# EasyEDA schematic SCH_Type B_2022-05-16.json
TITLE: Sheet_1; REV: 1.0; Date: 2022-05-16; Sheet: 1/1; Drawn By: baggioedoardo03; Company: Your Company
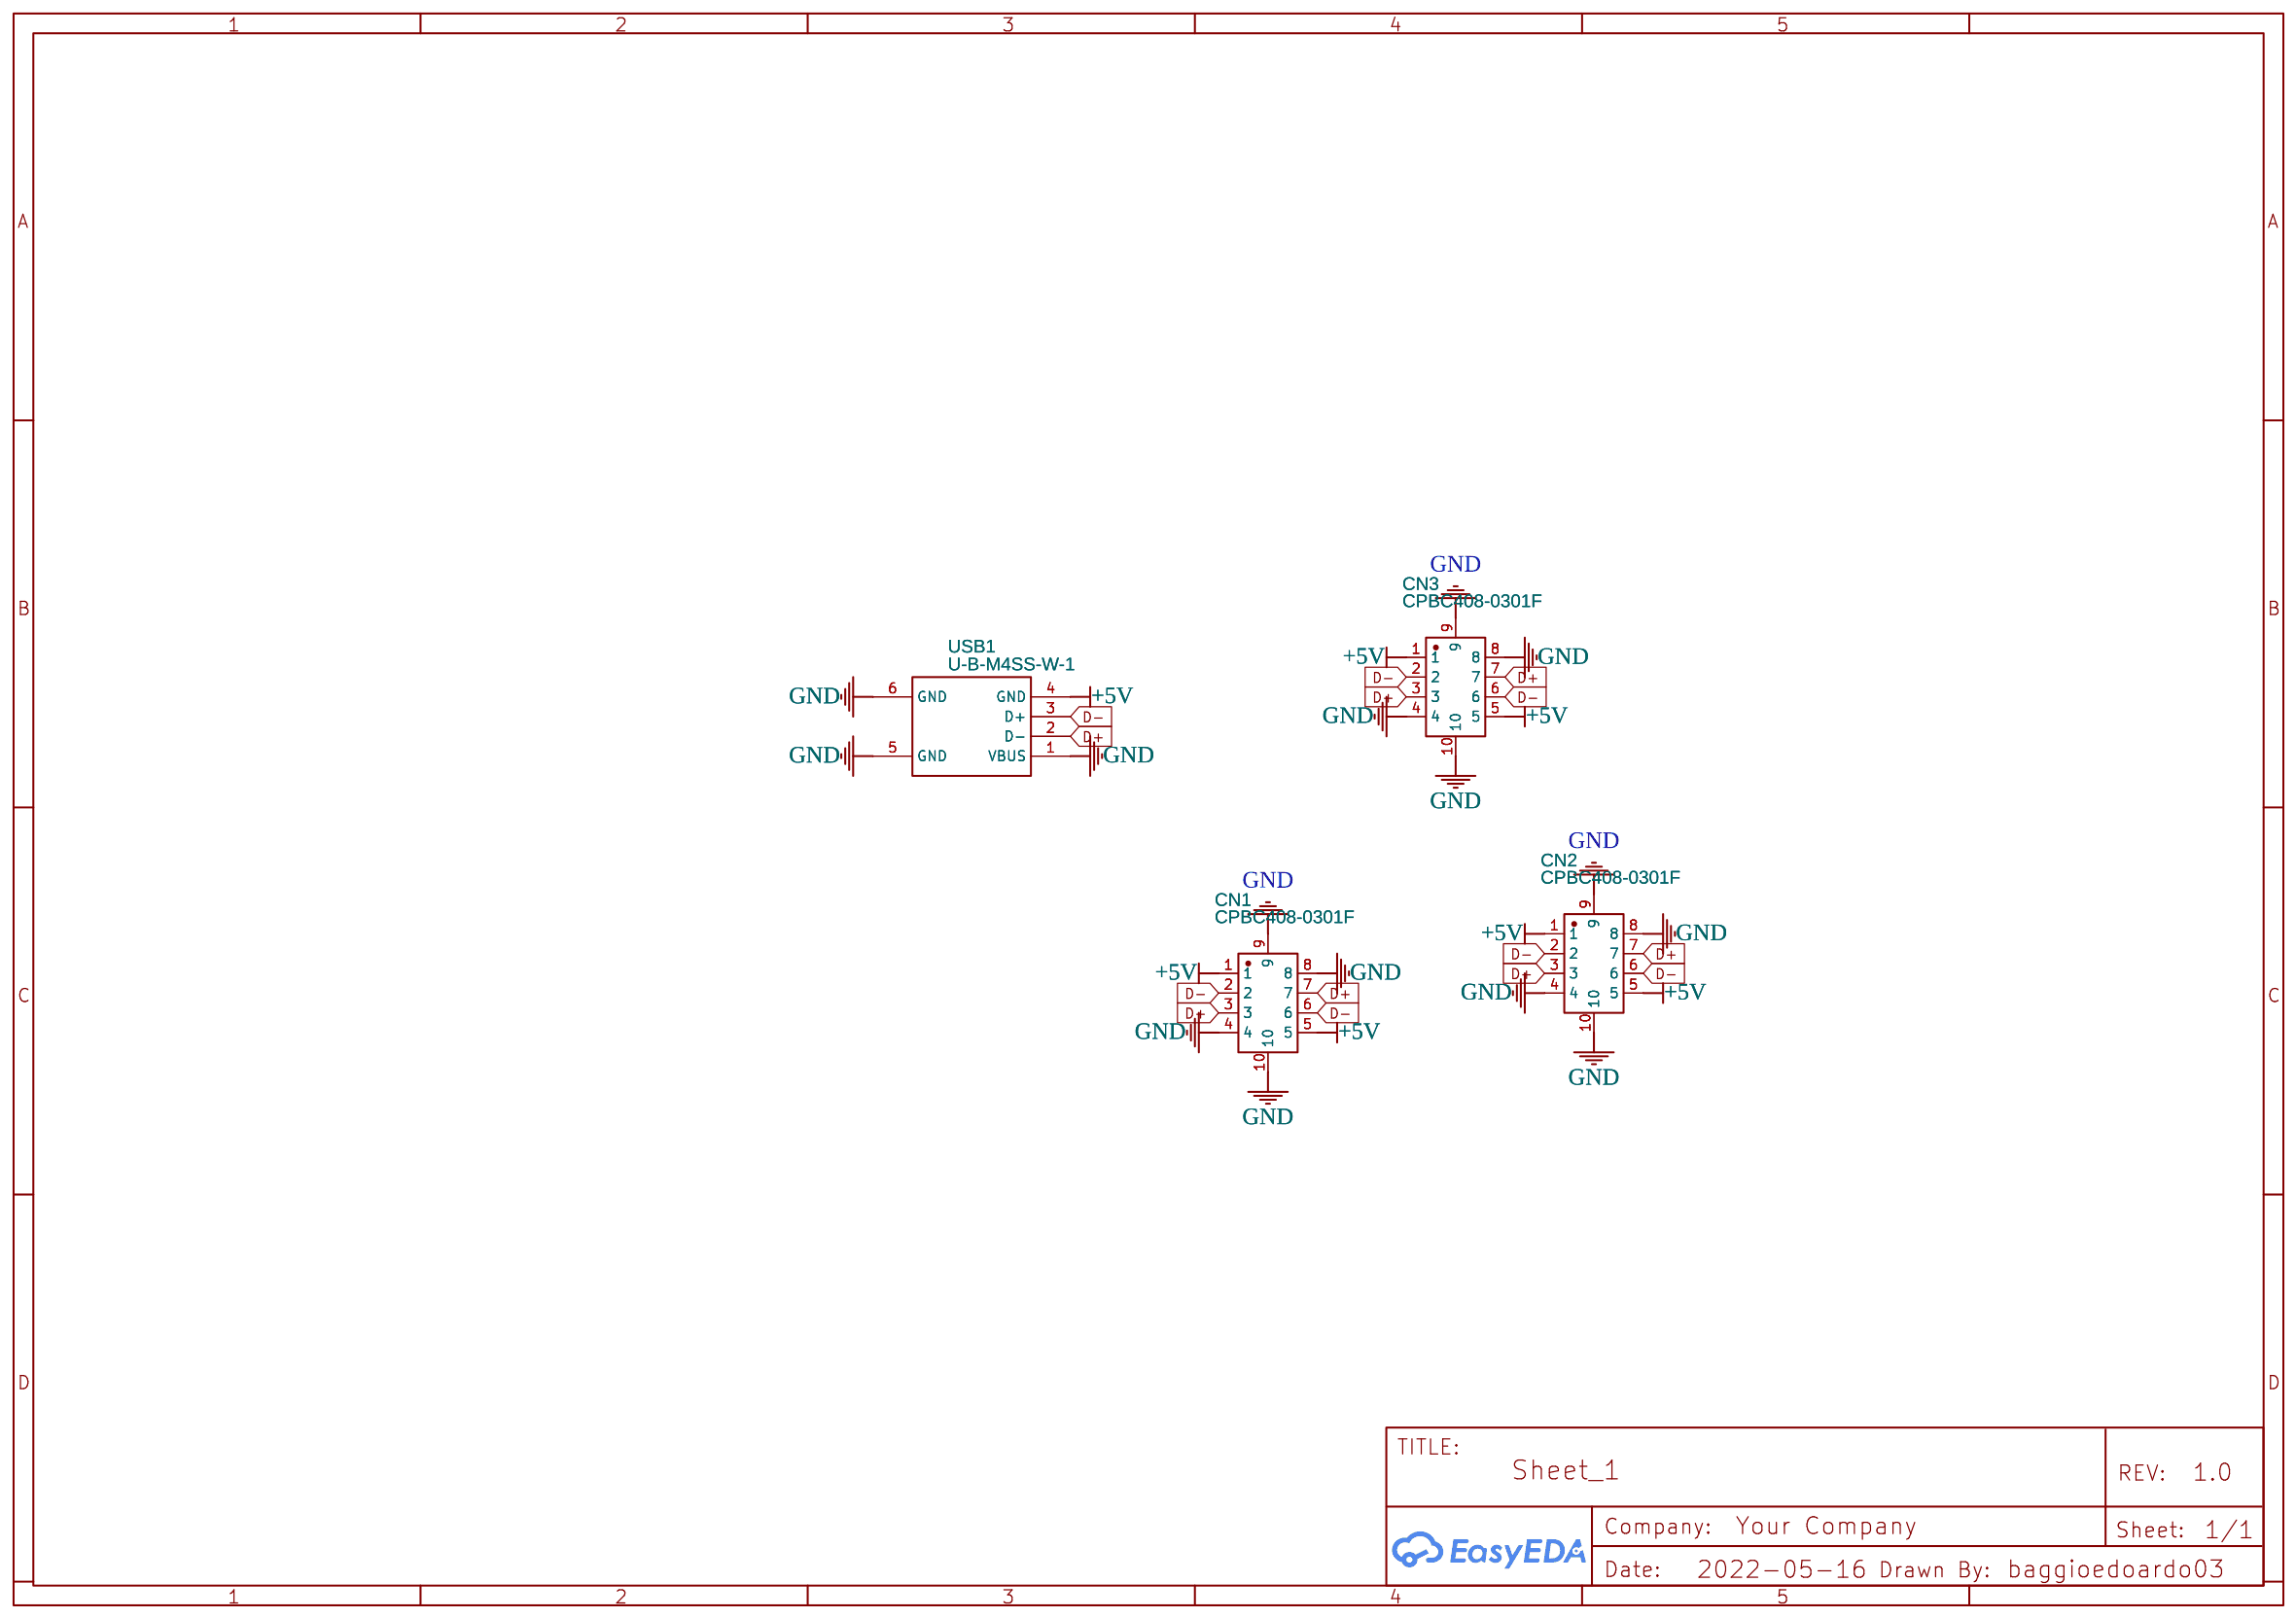
[diagram p0: schematic sheet]

## Parts
CN1  CPBC408-0301F  [CONN-SMD_CPBC408-0301F]
CN2  CPBC408-0301F  [CONN-SMD_CPBC408-0301F]
CN3  CPBC408-0301F  [CONN-SMD_CPBC408-0301F]
USB1  U-B-M4SS-W-1  [USB-B-SMD_U-B-M4SS-W-1]

## Library data of the parts
CN1-CN3 = CPBC408-0301F: Supplier: LCSC; Supplier Part: C841002; Manufacturer: SMK Corp.; Contributor: LCSC; JLCPCB Part Class: Extended Part
USB1 = U-B-M4SS-W-1: Supplier: LCSC; Supplier Part: C530599; Manufacturer: Korean Hroparts Elec; Contributor: LCSC; JLCPCB Part Class: Extended Part

## Nets
+5V: CN1.1 CN1.5 CN2.1 CN2.5 CN3.1 CN3.5 USB1.4(GND)
GND: CN1.4 CN1.8 CN1.9 CN1.10 CN2.4 CN2.8 CN2.9 CN2.10 CN3.4 CN3.8 CN3.9 CN3.10 USB1.1(VBUS) USB1.5(GND) USB1.6(GND)
D+: CN1.3 CN1.7 CN2.3 CN2.7 CN3.3 CN3.7 USB1.2(D-)
D-: CN1.2 CN1.6 CN2.2 CN2.6 CN3.2 CN3.6 USB1.3(D+)
